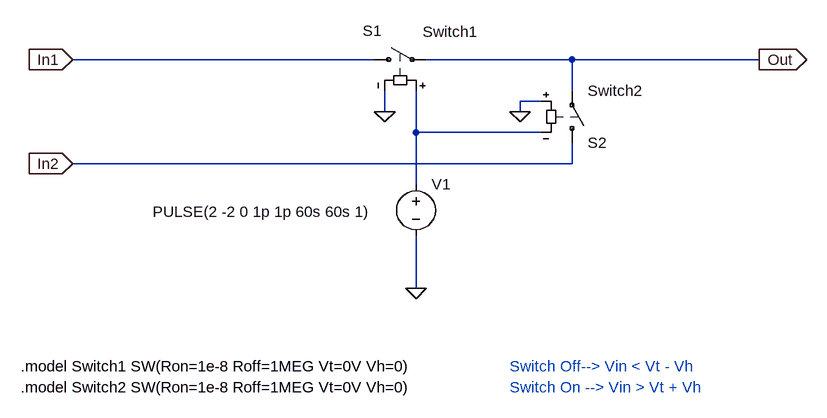
[diagram p0: schematic Toggle_Switch.asc]
Toggle_Switch.asc, the LTspice schematic file:
Version 4
SHEET 1 1412 680
WIRE 208 -48 -256 -48
WIRE 512 -48 288 -48
WIRE 800 -48 512 -48
WIRE 512 0 512 -48
WIRE 464 16 432 16
WIRE 224 32 224 0
WIRE 432 32 432 16
WIRE 272 64 272 0
WIRE 464 64 272 64
WIRE 512 112 512 80
WIRE 512 112 -256 112
WIRE 272 144 272 64
WIRE 272 304 272 224
FLAG -256 -48 In1
IOPIN -256 -48 In
FLAG 800 -48 Out
IOPIN 800 -48 Out
FLAG 272 304 0
FLAG 432 32 0
FLAG 224 32 0
FLAG -256 112 In2
IOPIN -256 112 In
SYMBOL sw 192 -48 R270
WINDOW 0 44 -2 VRight 2
WINDOW 3 43 90 VRight 2
SYMATTR InstName S1
SYMATTR Value Switch1
SYMBOL sw 512 96 M180
SYMATTR InstName S2
SYMATTR Value Switch2
SYMBOL voltage 272 128 R0
WINDOW 3 -405 58 Left 2
WINDOW 123 0 0 Left 0
WINDOW 39 0 0 Left 0
SYMATTR Value PULSE(2 -2 0 1p 1p 60s 60s 1)
SYMATTR InstName V1
TEXT -336 424 Left 2 !.model Switch1 SW(Ron=1e-8 Roff=1MEG Vt=0V Vh=0)
TEXT -336 456 Left 2 !.model Switch2 SW(Ron=1e-8 Roff=1MEG Vt=0V Vh=0)
TEXT 416 456 Left 2 ;Switch On --> Vin > Vt + Vh
TEXT 416 424 Left 2 ;Switch Off--> Vin < Vt - Vh

The netlist it stands for:
* Toggle_Switch.asc
S1 In1 Out N001 0 Switch1
S2 In2 Out 0 N001 Switch2
V1 N001 0 PULSE(2 -2 0 1p 1p 60s 60s 1)
.model Switch1 SW(Ron=1e-8 Roff=1MEG Vt=0V Vh=0)
.model Switch2 SW(Ron=1e-8 Roff=1MEG Vt=0V Vh=0)
* Switch On --> Vin > Vt + Vh
* Switch Off--> Vin < Vt - Vh
.backanno
.end